# Altium schematic sheet 07_FPGA.SchDoc: FPGA
size A3; Organization: Lime Microsystems; Address1: Surrey Tech Centre; Address2: Guildford GU2 7YG; Address3: Surrey; Address4: United Kingdom; Revision: v1.3; SheetNumber: 7; SheetTotal: 9
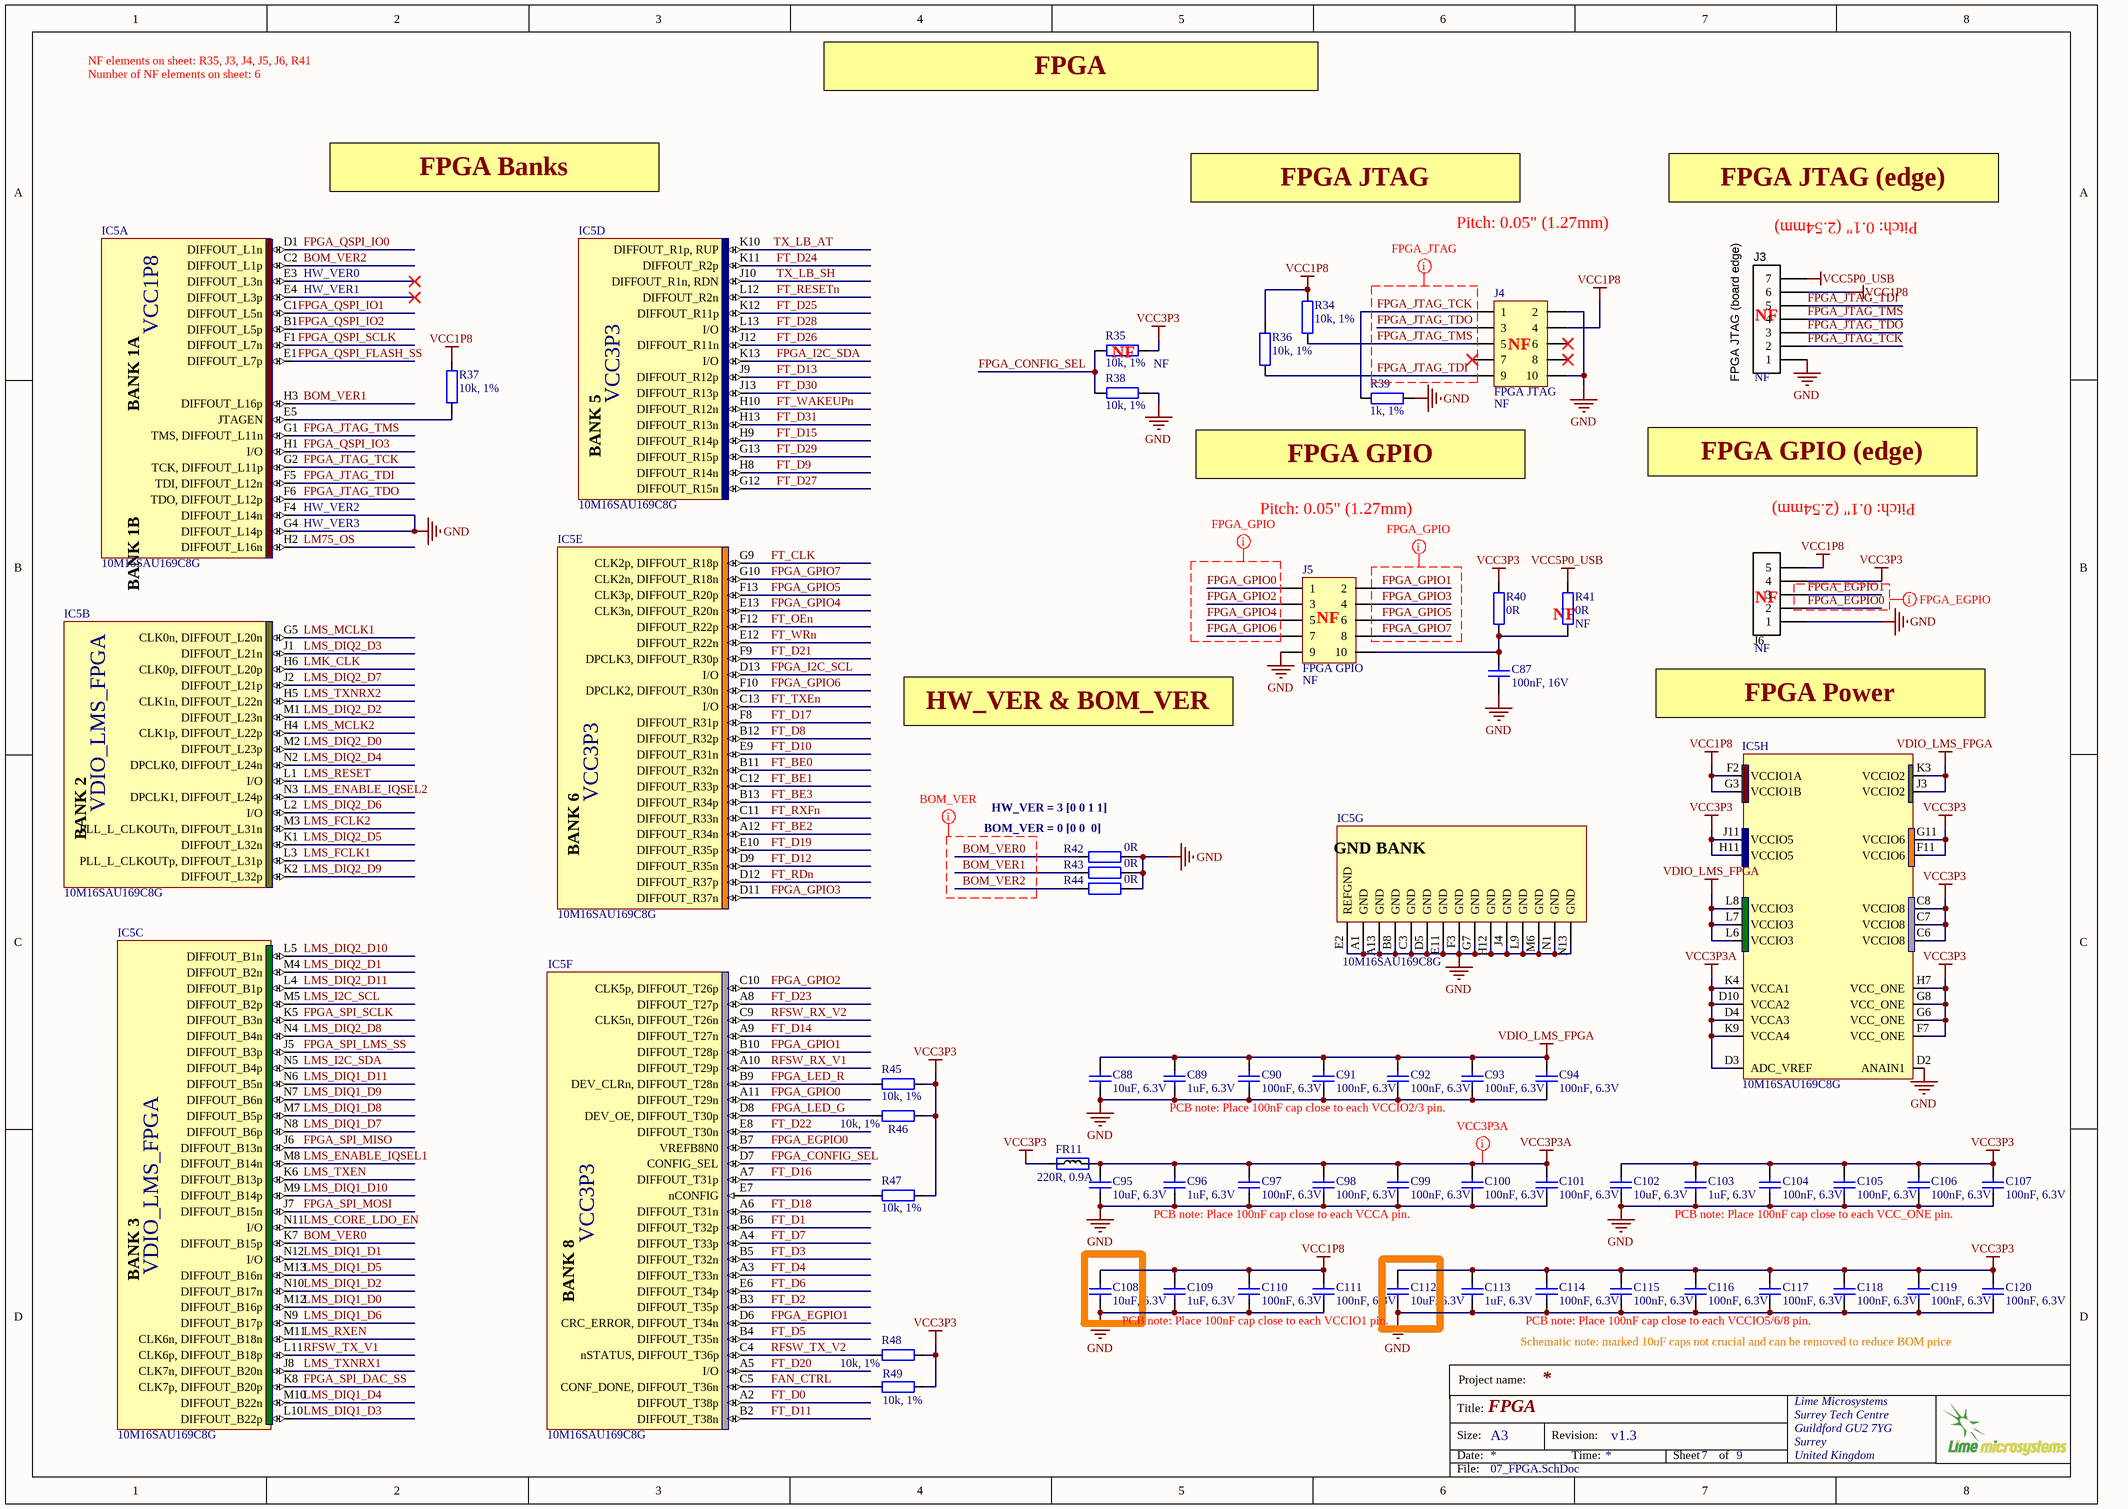
[diagram p0: 07_FPGA.SchDoc]

## Parts
C87  100nF, 16V  [CAP0402]
C88  10uF, 6.3V  [CAP0603]
C89  1uF, 6.3V  [CAP0201]
C90  100nF, 6.3V  [CAP0201]
C91  100nF, 6.3V  [CAP0201]
C92  100nF, 6.3V  [CAP0201]
C93  100nF, 6.3V  [CAP0201]
C94  100nF, 6.3V  [CAP0201]
C95  10uF, 6.3V  [CAP0603]
C96  1uF, 6.3V  [CAP0201]
C97  100nF, 6.3V  [CAP0201]
C98  100nF, 6.3V  [CAP0201]
C99  100nF, 6.3V  [CAP0201]
C100  100nF, 6.3V  [CAP0201]
C101  100nF, 6.3V  [CAP0201]
C102  10uF, 6.3V  [CAP0603]
C103  1uF, 6.3V  [CAP0201]
C104  100nF, 6.3V  [CAP0201]
C105  100nF, 6.3V  [CAP0201]
C106  100nF, 6.3V  [CAP0201]
C107  100nF, 6.3V  [CAP0201]
C108  10uF, 6.3V  [CAP0603]
C109  1uF, 6.3V  [CAP0201]
C110  100nF, 6.3V  [CAP0201]
C111  100nF, 6.3V  [CAP0201]
C112  10uF, 6.3V  [CAP0603]
C113  1uF, 6.3V  [CAP0201]
C114  100nF, 6.3V  [CAP0201]
C115  100nF, 6.3V  [CAP0201]
C116  100nF, 6.3V  [CAP0201]
C117  100nF, 6.3V  [CAP0201]
C118  100nF, 6.3V  [CAP0201]
C119  100nF, 6.3V  [CAP0201]
C120  100nF, 6.3V  [CAP0201]
FR11  220R, 0.9A  [RES0402]
IC5  10M16SAU169C8G  [10M16SAU169C8G]  (parts A,B,C,D,E,F,G,H of 8)
J3  FPGA JTAG (board edge)  Assembly Info: NF  [Header7x1_TH_v2]
J4  FPGA JTAG  Assembly Info: NF  [SWD_10_pin]
J5  FPGA GPIO  Assembly Info: NF  [SWD_10_pin]
J6  Assembly Info: NF  [Header5x1_TH_v2]  (hidden comment: FPGA EGPIO (board edge))
R34  10k, 1%  [RES0402]
R35  10k, 1%  Assembly Info: NF  [RES0402]
R36  10k, 1%  [RES0402]
R37  10k, 1%  [RES0402]
R38  10k, 1%  [RES0402]
R39  1k, 1%  [RES0402]
R40  0R  [RES0402]
R41  0R  Assembly Info: NF  [RES0402]
R42  0R  [RES0402]
R43  0R  [RES0402]
R44  0R  [RES0402]
R45  10k, 1%  [RES0402]
R46  10k, 1%  [RES0402]
R47  10k, 1%  [RES0402]
R48  10k, 1%  [RES0402]
R49  10k, 1%  [RES0402]

## Nets
GND: C87.1 C88.1 C89.2 C90.2 C91.2 C92.2 C93.2 C94.2 C95.1 C96.2 C97.2 C98.2 C99.2 C100.2 C101.2 C102.1 C103.2 C104.2 C105.2 C106.2 C107.2 C108.1 C109.2 C110.2 C111.2 C112.1 C113.2 C114.2 C115.2 C116.2 C117.2 C118.2 C119.2 C120.2 IC5.A1(GND) IC5.A13(GND) IC5.B8(GND) IC5.C3(GND) IC5.D2(ANAIN1) IC5.D5(GND) IC5.E2(REFGND) IC5.E11(GND) IC5.F3(GND) IC5.F4(DIFFOUT_L14n) IC5.G4(DIFFOUT_L14p) IC5.G7(GND) IC5.H12(GND) IC5.J4(GND) IC5.L9(GND) IC5.M6(GND) IC5.N1(GND) IC5.N13(GND) J3.1 J4.2 J4.10 J5.9 J6.1 R38.1 R39.2 R42.1 R43.1 R44.1
VCC1P8: C108.2 C109.1 C110.1 C111.1 IC5.F2(VCCIO1A) IC5.G3(VCCIO1B) J3.6 J4.4 J6.5 R34.2 R36.2 R37.1
VCC3P3: C102.2 C103.1 C104.1 C105.1 C106.1 C107.1 C112.2 C113.1 C114.1 C115.1 C116.1 C117.1 C118.1 C119.1 C120.1 FR11.1 IC5.C6(VCCIO8) IC5.C7(VCCIO8) IC5.C8(VCCIO8) IC5.F7(VCC_ONE) IC5.F11(VCCIO6) IC5.G6(VCC_ONE) IC5.G8(VCC_ONE) IC5.G11(VCCIO6) IC5.H7(VCC_ONE) IC5.H11(VCCIO5) IC5.J11(VCCIO5) J6.4 R35.1 R40.1 R45.1 R46.1 R47.1 R48.1 R49.1
VCC3P3A: C95.2 C96.1 C97.1 C98.1 C99.1 C100.1 C101.1 FR11.2 IC5.D3(ADC_VREF) IC5.D4(VCCA3) IC5.D10(VCCA2) IC5.K4(VCCA1) IC5.K9(VCCA4)
VCC5P0_USB: J3.7 R41.1
VDIO_LMS_FPGA: C88.2 C89.1 C90.1 C91.1 C92.1 C93.1 C94.1 IC5.J3(VCCIO2) IC5.K3(VCCIO2) IC5.L6(VCCIO3) IC5.L7(VCCIO3) IC5.L8(VCCIO3)
BOM_VER0: IC5.K7(DIFFOUT_B15p) R42.2
BOM_VER1: IC5.H3(DIFFOUT_L16p) R43.2
BOM_VER2: IC5.C2(DIFFOUT_L1p) R44.2
FAN_CTRL: IC5.C5(CONF_DONE,_DIFFOUT_T36n) R49.2
FPGA_CONFIG_SEL: IC5.D7(CONFIG_SEL) R35.2 R38.2
FPGA_EGPIO0: IC5.B7(VREFB8N0) J6.2
FPGA_EGPIO1: IC5.D6(CRC_ERROR,_DIFFOUT_T34n) J6.3
FPGA_GPIO0: IC5.A11(DIFFOUT_T29n) J5.1
FPGA_GPIO1: IC5.B10(DIFFOUT_T28p) J5.2
FPGA_GPIO2: IC5.C10(CLK5p,_DIFFOUT_T26p) J5.3
FPGA_GPIO3: IC5.D11(DIFFOUT_R37n) J5.4
FPGA_GPIO4: IC5.E13(CLK3n,_DIFFOUT_R20n) J5.5
FPGA_GPIO5: IC5.F13(CLK3p,_DIFFOUT_R20p) J5.6
FPGA_GPIO6: IC5.F10(DPCLK2,_DIFFOUT_R30n) J5.7
FPGA_GPIO7: IC5.G10(CLK2n,_DIFFOUT_R18n) J5.8
FPGA_I2C_SCL: IC5.D13(I/O)
FPGA_I2C_SDA: IC5.K13(I/O)
FPGA_JTAG_TCK: IC5.G2(TCK,_DIFFOUT_L11p) J3.2 J4.1 R39.1
FPGA_JTAG_TDI: IC5.F5(TDI,_DIFFOUT_L12n) J3.5 J4.9 R36.1
FPGA_JTAG_TDO: IC5.F6(TDO,_DIFFOUT_L12p) J3.3 J4.3
FPGA_JTAG_TMS: IC5.G1(TMS,_DIFFOUT_L11n) J3.4 J4.5 R34.1
FPGA_LED_G: IC5.D8(DEV_OE,_DIFFOUT_T30p) R46.2
FPGA_LED_R: IC5.B9(DEV_CLRn,_DIFFOUT_T28n) R45.2
FPGA_QSPI_FLASH_SS: IC5.E1(DIFFOUT_L7p)
FPGA_QSPI_IO0: IC5.D1(DIFFOUT_L1n)
FPGA_QSPI_IO1: IC5.C1(DIFFOUT_L5n)
FPGA_QSPI_IO2: IC5.B1(DIFFOUT_L5p)
FPGA_QSPI_IO3: IC5.H1(I/O)
FPGA_QSPI_SCLK: IC5.F1(DIFFOUT_L7n)
FPGA_SPI_DAC_SS: IC5.K8(CLK7p,_DIFFOUT_B20p)
FPGA_SPI_LMS_SS: IC5.J5(DIFFOUT_B3p)
FPGA_SPI_MISO: IC5.J6(DIFFOUT_B13n)
FPGA_SPI_MOSI: IC5.J7(DIFFOUT_B15n)
FPGA_SPI_SCLK: IC5.K5(DIFFOUT_B3n)
FT_BE0: IC5.B11(DIFFOUT_R32n)
FT_BE1: IC5.C12(DIFFOUT_R33p)
FT_BE2: IC5.A12(DIFFOUT_R34n)
FT_BE3: IC5.B13(DIFFOUT_R34p)
FT_CLK: IC5.G9(CLK2p,_DIFFOUT_R18p)
FT_D0: IC5.A2(DIFFOUT_T38p)
FT_D1: IC5.B6(DIFFOUT_T32p)
FT_D2: IC5.B3(DIFFOUT_T35p)
FT_D3: IC5.B5(DIFFOUT_T32n)
FT_D4: IC5.A3(DIFFOUT_T33n)
FT_D5: IC5.B4(DIFFOUT_T35n)
FT_D6: IC5.E6(DIFFOUT_T34p)
FT_D7: IC5.A4(DIFFOUT_T33p)
FT_D8: IC5.B12(DIFFOUT_R32p)
FT_D9: IC5.H8(DIFFOUT_R14n)
FT_D10: IC5.E9(DIFFOUT_R31n)
FT_D11: IC5.B2(DIFFOUT_T38n)
FT_D12: IC5.D9(DIFFOUT_R35n)
FT_D13: IC5.J9(DIFFOUT_R12p)
FT_D14: IC5.A9(DIFFOUT_T27n)
FT_D15: IC5.H9(DIFFOUT_R14p)
FT_D16: IC5.A7(DIFFOUT_T31p)
FT_D17: IC5.F8(DIFFOUT_R31p)
FT_D18: IC5.A6(DIFFOUT_T31n)
FT_D19: IC5.E10(DIFFOUT_R35p)
FT_D20: IC5.A5(I/O)
FT_D21: IC5.F9(DPCLK3,_DIFFOUT_R30p)
FT_D22: IC5.E8(DIFFOUT_T30n)
FT_D23: IC5.A8(DIFFOUT_T27p)
FT_D24: IC5.K11(DIFFOUT_R2p)
FT_D25: IC5.K12(DIFFOUT_R11p)
FT_D26: IC5.J12(DIFFOUT_R11n)
FT_D27: IC5.G12(DIFFOUT_R15n)
FT_D28: IC5.L13(I/O)
FT_D29: IC5.G13(DIFFOUT_R15p)
FT_D30: IC5.J13(DIFFOUT_R13p)
FT_D31: IC5.H13(DIFFOUT_R13n)
FT_OEn: IC5.F12(DIFFOUT_R22p)
FT_RDn: IC5.D12(DIFFOUT_R37p)
FT_RESETn: IC5.L12(DIFFOUT_R2n)
FT_RXFn: IC5.C11(DIFFOUT_R33n)
FT_TXEn: IC5.C13(I/O)
FT_WAKEUPn: IC5.H10(DIFFOUT_R12n)
FT_WRn: IC5.E12(DIFFOUT_R22n)
LM75_OS: IC5.H2(DIFFOUT_L16n)
LMK_CLK: IC5.H6(CLK0p,_DIFFOUT_L20p)
LMS_CORE_LDO_EN: IC5.N11(I/O)
LMS_DIQ1_D0: IC5.M12(DIFFOUT_B16p)
LMS_DIQ1_D1: IC5.N12(I/O)
LMS_DIQ1_D2: IC5.N10(DIFFOUT_B17n)
LMS_DIQ1_D3: IC5.L10(DIFFOUT_B22p)
LMS_DIQ1_D4: IC5.M10(DIFFOUT_B22n)
LMS_DIQ1_D5: IC5.M13(DIFFOUT_B16n)
LMS_DIQ1_D6: IC5.N9(DIFFOUT_B17p)
LMS_DIQ1_D7: IC5.N8(DIFFOUT_B6p)
LMS_DIQ1_D8: IC5.M7(DIFFOUT_B5p)
LMS_DIQ1_D9: IC5.N7(DIFFOUT_B6n)
LMS_DIQ1_D10: IC5.M9(DIFFOUT_B14p)
LMS_DIQ1_D11: IC5.N6(DIFFOUT_B5n)
LMS_DIQ2_D0: IC5.M2(DIFFOUT_L23p)
LMS_DIQ2_D1: IC5.M4(DIFFOUT_B2n)
LMS_DIQ2_D2: IC5.M1(DIFFOUT_L23n)
LMS_DIQ2_D3: IC5.J1(DIFFOUT_L21n)
LMS_DIQ2_D4: IC5.N2(DPCLK0,_DIFFOUT_L24n)
LMS_DIQ2_D5: IC5.K1(DIFFOUT_L32n)
LMS_DIQ2_D6: IC5.L2(I/O)
LMS_DIQ2_D7: IC5.J2(DIFFOUT_L21p)
LMS_DIQ2_D8: IC5.N4(DIFFOUT_B4n)
LMS_DIQ2_D9: IC5.K2(DIFFOUT_L32p)
LMS_DIQ2_D10: IC5.L5(DIFFOUT_B1n)
LMS_DIQ2_D11: IC5.L4(DIFFOUT_B1p)
LMS_ENABLE_IQSEL1: IC5.M8(DIFFOUT_B14n)
LMS_ENABLE_IQSEL2: IC5.N3(DPCLK1,_DIFFOUT_L24p)
LMS_FCLK1: IC5.L3(PLL_L_CLKOUTp,_DIFFOUT_L31p)
LMS_FCLK2: IC5.M3(PLL_L_CLKOUTn,_DIFFOUT_L31n)
LMS_I2C_SCL: IC5.M5(DIFFOUT_B2p)
LMS_I2C_SDA: IC5.N5(DIFFOUT_B4p)
LMS_MCLK1: IC5.G5(CLK0n,_DIFFOUT_L20n)
LMS_MCLK2: IC5.H4(CLK1p,_DIFFOUT_L22p)
LMS_RESET: IC5.L1(I/O)
LMS_RXEN: IC5.M11(CLK6n,_DIFFOUT_B18n)
LMS_TXEN: IC5.K6(DIFFOUT_B13p)
LMS_TXNRX1: IC5.J8(CLK7n,_DIFFOUT_B20n)
LMS_TXNRX2: IC5.H5(CLK1n,_DIFFOUT_L22n)
RFSW_RX_V1: IC5.A10(DIFFOUT_T29p)
RFSW_RX_V2: IC5.C9(CLK5n,_DIFFOUT_T26n)
RFSW_TX_V1: IC5.L11(CLK6p,_DIFFOUT_B18p)
RFSW_TX_V2: IC5.C4(nSTATUS,_DIFFOUT_T36p) R48.2
TX_LB_AT: IC5.K10(DIFFOUT_R1p,_RUP)
TX_LB_SH: IC5.J10(DIFFOUT_R1n,_RDN)
NetC87_2: C87.2 J5.10 R40.2 R41.2
NetIC5_E5: IC5.E5(JTAGEN) R37.2
NetIC5_E7: IC5.E7(nCONFIG) R47.2

Not connected (* = marked no-connect by the designer): IC5 E3(DIFFOUT_L3n)* E4(DIFFOUT_L3p)*; J4 6* 7* 8*

## Layout directives
net class FPGA_JTAG: FPGA_JTAG_TCK, FPGA_JTAG_TDI, FPGA_JTAG_TDO, FPGA_JTAG_TMS
net class VCC3P3A: VCC3P3A
net class FPGA_GPIO: FPGA_GPIO0, FPGA_GPIO1, FPGA_GPIO2, FPGA_GPIO3, FPGA_GPIO4, FPGA_GPIO5, FPGA_GPIO6, FPGA_GPIO7
net class FPGA_EGPIO: FPGA_EGPIO0, FPGA_EGPIO1
net class BOM_VER: BOM_VER0, BOM_VER1, BOM_VER2

## Notes on the sheet
- NF elements on sheet: R35, J3, J4, J5, J6, R41
- Number of NF elements on sheet: 6
- FPGA
- FPGA Banks
- FPGA JTAG
- Pitch: 0.05" (1.27mm)
- FPGA JTAG (edge)
- (near J3) Pitch: 0.1" (2.54mm)
- (near IC5) HW_VER0
- (near IC5) HW_VER1
- (near J3) NF
- VCC1P8
- (near R35) NF
- (near J4) NF
- VCC3P3
- (near IC5) HW_VER2
- (near R39) FPGA GPIO
- FPGA GPIO (edge)
- (near J6) Pitch: 0.1" (2.54mm)
- (near IC5) HW_VER3
- (near J5) NF
- (near R41) NF
- (near J6) NF
- HW_VER & BOM_VER
- FPGA Power
- VDIO_LMS_FPGA
- (near R42) BOM_VER = 0 [0 0  0]
- HW_VER = 3 [0 0 1 1]
- PCB note: Place 100nF cap close to each VCCIO2/3 pin.
- PCB note: Place 100nF cap close to each VCCA pin.
- PCB note: Place 100nF cap close to each VCC_ONE pin.
- PCB note: Place 100nF cap close to each VCCIO1 pin.
- PCB note: Place 100nF cap close to each VCCIO5/6/8 pin.
- Schematic note: marked 10uF caps not crucial and can be removed to reduce BOM price
- Project name:
- Title:
- Size:
- Date:
- A3
- Revision:
- Time:
- Sheet
- of
- File:
- (in symbol 10M16SAU169C8G, part A) BANK 1A; BANK 1B
- (in symbol 10M16SAU169C8G, part B) BANK 2
- (in symbol 10M16SAU169C8G, part C) BANK 3
- (in symbol 10M16SAU169C8G, part D) BANK 5
- (in symbol 10M16SAU169C8G, part E) BANK 6
- (in symbol 10M16SAU169C8G, part F) BANK 8
- (in symbol 10M16SAU169C8G, part G) GND BANK

## Library data of the parts
C87 = Cap_0402: Manufacturer: Murata Electronics; Manufacturer Part Number: GRM155R71C104KA88D; Part Description: 0.10µF ±10% 16V X7R Ceramic Capacitor -55°C ~ 125°C Surface Mount, MLCC 0402 (1005 Metric) 0.039" L x 0.020" W (1.00mm x 0.50mm); Tolerance: 10 %; Type: General Purpose MLCC; Capacitance: 0.1 uF; Case Length: 1 mm; Dielectric: X7R; Case Height: 0.5 mm; Temperature Coefficient / Code: +/- 15 %; Value: 100nF, 16V; Supplier 1: Mouser; Supplier Part Number 1: 81-GRM155R71C104KA88; Case Code - in: 0402; RoHS: RoHS Compliant; Operating Temperature Range: - 55 C to + 125 C; Series: GRM; Termination Style: SMD/SMT; Package / Case: 0402 (1005 metric); Voltage Rating DC: 16 V; Maximum Operating Temperature: + 125 C; Case Code - mm: 1005; Minimum Operating Temperature: - 55 C; Product Category: Low & Medium Capacitance SMD Ceramic Chip Capacitors; Packaging: Reel; Product: General Type MLCCs; Category: Multilayer Ceramic Capacitors MLCC - SMD/SMT; Brand: Murata Electronics; Case Width: 0.5 mm; RoHS - Mouser: Y; Standard Pack Qty: 10000; Minimum Order Quantity: 1; Reeling: True; Manufacturer Part Number 1: GRM155R71C104KA88D
C88 C95 C102 C108 C112 = Cap_0603: Manufacturer Part Number 1: CC0603MRX5R5BB106; Manufacturer: Yageo; Part Description: 10µF ±20% 6.3V X5R Ceramic Capacitor -55°C ~ 85°C Surface Mount, MLCC 0603 (1608 Metric) 0.063" L x 0.031" W (1.60mm x 0.80mm); Capacitance: 10µF; Tolerance: ±20%; Supplier 1: Digi-Key; Supplier Part Number 1: 311-1448-2-ND; Package / Case: 0603 (1608 Metric); Category: Capacitors; Voltage - Rated: 6.3V; Value: 10uF, 6.3V
C89 C96 C103 C109 C113 = Cap_0402: Manufacturer: TDK Corporation; Manufacturer Part Number 1: JMK063ABJ105MP-F; Part Description: 1µF ±20% 6.3V X5R Ceramic Capacitor -55°C ~ 85°C Surface Mount, MLCC 0201 (0603 Metric) 0.024" L x 0.012" W (0.60mm x 0.30mm); Value: 1uF, 20%; Tolerance: ±20%; Capacitance: 1.0µF; Temperature Coefficient: X5R; Supplier 1: Digi-Key; Supplier Part Number 1: 587-5864-2-ND; Applications: General Purpose; Features: -; Lead Style: -; Ratings: -; Thickness (Max): -; Lead Spacing: -; Height - Seated (Max): -; Size / Dimension: 0.024" L x 0.012" W (0.60mm x 0.30mm); Mounting Type: Surface Mount, MLCC; Operating Temperature: -55°C ~ 85°C; Package / Case: 0201 (0603 Metric); Packaging: Cut Tape (CT); Voltage - Rated: 6.3V; Category: Capacitors; RoHS: RoHS Compliant
C90-C94 C97-C101 C104-C107 C110 C111 C114-C120 = Cap_0402: Manufacturer: Murata; Manufacturer Part Number 1: GRT033C81A104KE01D; Part Description: 0.10µF ±10% 6.3V X6S Ceramic Capacitor -55°C ~ 105°C Surface Mount, MLCC 0201 (0603 Metric) 0.024" L x 0.012" W (0.60mm x 0.30mm); Capacitance: 0.1 uF; Dielectric: X6S; Brand: Murata Electronics; Type: Voltage and Temperature Derating Recommended Product; Voltage Rating DC: 6.3 VDC; Product Status: New Product; Tolerance: 10 %; Value: 100nF, 6.3V; Package / Case: 0201 (0603 metric); Width: 0.3 mm; Minimum Order Quantity: 1; Category: Multilayer Ceramic Capacitors MLCC - SMD/SMT; Termination Style: SMD/SMT; Case Code - mm: 0603; Maximum Operating Temperature: + 125 C; Length: 0.6 mm; Product: General Type MLCCs; Case Code - in: 0201; RoHS: RoHS Compliant; Minimum Operating Temperature: - 55 C; RoHS - Mouser: Y; Height: 0.3 mm; Packaging: Reel; Series: GRM; Reeling: True; Supplier 1: Digi-Key; Supplier Part Number 1: 490-12232-1-ND
FR11 = Ferrite: Manufacturer: TDK Corporation; Manufacturer Part Number 1: MPZ1005S221ET000; Part Description: FERRITE BEAD 220 OHM 0402 1LN; Impedance @ Frequency: 220 Ohm @ 100MHz; Current Rating: 900mA; DC Resistance (DCR): 220 mOhm Max; Supplier 1: Digi-Key; Package / Case: 0402 (1005 Metric); Category: Filters; Supplier Part Number 1: 445-9329-2-ND; Value: 220R, 0.9A
IC5 = 10M16SAU169C8G: Manufacturer: Altera; Part Description: IC FPGA/CPLD NV 130 I/O 169UBGA; Number of LABs/CLBs: 1000; Number of Logic Elements/Cells: 16000; Total RAM Bits: 562176; Number of I/O: 130; Voltage - Supply: 2.85 V ~ 3.465 V; Supplier 1: Digi-Key; RoHS: RoHS Compliant; Number of Gates: -; Mounting Type: Surface Mount; Operating Temperature: 0°C ~ 85°C (TJ); Package / Case: 169-LFBGA; Supplier Device Package: 169-UBGA (11x11); Category: Integrated Circuits (ICs); Manufacturer Part Number 1: 10M16SAU169C8G; Supplier Part Number 1: 544-3110-ND
J3 = Header7P: Header, 7-pin; Manufacturer: Sullins Connector Solutions; Manufacturer Part Number 1: PEC07SAAN; Part Description: 7 Positions Header, Unshrouded, Breakaway Connector 0.100" (2.54mm) Through Hole Tin; Number of Positions Loaded: All; Pitch: 0.100" (2.54mm); Number of Positions: 7; Connector Type: Header, Unshrouded, Breakaway; Supplier 1: Digi-Key; Color: Black; Packaging: Bulk; Category: Connectors, Interconnects; Contact Finish: Tin; Number of Rows: 1; RoHS: RoHS Compliant; Contact Type: Male Pin; Mounting Type: Through Hole; Features: -; Contact Mating Length: 0.230" (5.84mm); Termination: Solder; Fastening Type: -; Contact Finish Thickness: 100µin (2.54µm); Row Spacing: -; Supplier Part Number 1: S1012E-07-ND
J4 J5 = Header 5X2_SWD: Header, 5-Pin, Dual row; Manufacturer Part Number 1: M50-3600542; Manufacturer: Harwin Inc; Part Description: CONN HDR 1.27MM SMD AU 10POS; Number of Positions: 10; Molding Height Above Board: 0.039" (1.00mm); Row Spacing: 0.050" (1.27mm); Number of Positions Loaded: All; Connector Type: Unshrouded; Supplier 1: Digi-Key; Contact Mating Length: 0.118" (3.00mm); Category: Connectors, Interconnects; Color: Black; RoHS: RoHS Compliant; Number of Rows: 2; Contact Finish Thickness: 3µin (0.08µm); Height Stacking (Mating): -; Contact Finish: Gold; Termination: Solder; Mounting Type: Surface Mount; Pitch: 0.050" (1.27mm); Features: -; Packaging: Bulk; Supplier Part Number 1: 952-1389-ND
J6 = Header5P: Header, 5-pin; Manufacturer: Amphenol FCI; Manufacturer Part Number 1: 69190-405HLF; Part Description: 5 Positions Header Connector 0.100" (2.54mm) Through Hole Tin; Pitch - Mating: 0.100" (2.54mm); Style: Board to Board; Shrouding: Unshrouded; Number of Positions: 5; Number of Positions Loaded: All; Contact Length - Mating: 0.230" (5.84mm); Contact Length - Post: 0.120" (3.05mm); Overall Contact Length: 0.450" (11.43mm); Material Flammability Rating: UL94 V-0; Supplier 1: Digi-Key; Supplier Part Number 1: 609-4726-ND; RoHS: RoHS Compliant; Category: Connectors, Interconnects; Stock 1: 2326; Pricing 1: 1=0.28, 10=0.26, 100=0.1799, 500=0.15224, 1000=0.12456, 5000=0.11072, 10000=0.10034 (USD); Packaging: Bulk; Part Status: Active; Connector Type: Header; Contact Type: Male Pin; Number of Rows: 1; Row Spacing - Mating: -; Mounting Type: Through Hole; Termination: Press-Fit, Solder; Fastening Type: Push-Pull; Insulation Height: 0.100" (2.54mm); Contact Shape: Square; Contact Finish - Mating: Tin; Contact Finish Thickness - Mating: 100µin (2.54µm); Contact Finish - Post: Tin; Contact Material: Phosphor Bronze; Insulation Material: Polycyclohexylenedimethylene Terephthalate (PCT), Glass Filled; Features: -; Operating Temperature: -; Ingress Protection: -; Insulation Color: Black; Current Rating: -; Voltage Rating: -; Mated Stacking Heights: -; Contact Finish Thickness - Post: -; Applications: -; ComponentLink1URL: http://portal.fciconnect.com/Comergent//fci/drawing/69190.pdf; ComponentLink1Description: http://portal.fciconnect.com/Comergent//fci/drawing/69190.pdf
R34-R38 R45-R49 = Res_0402: Manufacturer: Yageo; Manufacturer Part Number 1: RC0402FR-0710KL; Part Description: RES SMD 10K OHM 1% 1/16W 0402; Temperature Coefficient: ±100ppm/°C; Power (Watts): 0.063W, 1/16W; Value: 10k, 1%; Supplier 1: Digi-Key; Supplier Part Number 1: 311-10.0KLRTR-ND; Resistance (Ohms): 10k; Packaging: Tape & Reel (TR); RoHS: RoHS Compliant; Package / Case: 0402 (1005 Metric); Tolerance: ±1%; Operating Temperature: -55°C ~ 155°C; Size / Dimension: 0.039" L x 0.020" W (1.00mm x 0.50mm); Number of Terminations: 2; Category: Resistors; Height: 0.016" (0.40mm); Supplier Device Package: 0402; Features: Moisture Resistant; Composition: Thick Film
R39 = Res_0402: Manufacturer: Stackpole Electronics Inc; Manufacturer Part Number 1: RMCF0402FT1K00; Part Description: RES SMD 1K OHM 1% 1/16W 0402; Temperature Coefficient: ±100ppm/°C; Power (Watts): 0.063W, 1/16W; Value: 1k, 1%; Supplier 1: Digi-Key; Supplier Part Number 1: RMCF0402FT1K00TR-ND; Package / Case: 0402 (1005 Metric); Supplier Device Package: 0402; Height: 0.016" (0.40mm); Size / Dimension: 0.039" L x 0.020" W (1.00mm x 0.50mm); Number of Terminations: 2; Packaging: Cut Tape (CT); Category: Resistors; Composition: Thick Film; Resistance (Ohms): 1k; Tolerance: ±1%; Features: Moisture Resistant; Operating Temperature: -55°C ~ 155°C; RoHS: RoHS Compliant
R40 R41 = Res_0402: Manufacturer: Yageo; Part Description: RES SMD 0.0OHM JUMPER 1/16W 0402; Manufacturer Part Number 1: RC0402JR-070RL; Supplier 1: Digi-Key; Supplier Part Number 1: 311-0.0JRTR-ND; Composition: Thick Film; Package / Case: 0402 (1005 Metric); Category: Resistors; Value: 0R
R42-R44 = Res_0402: Manufacturer: Yageo; Part Description: RES SMD 0.0OHM JUMPER 1/16W 0402; Supplier 1: Digi-Key; Supplier Part Number 1: 311-0.0JRTR-ND; Composition: Thick Film; Package / Case: 0402 (1005 Metric); Category: Resistors; Value: 0R